# EAGLE design lcd (EAGLE 6.5.0)
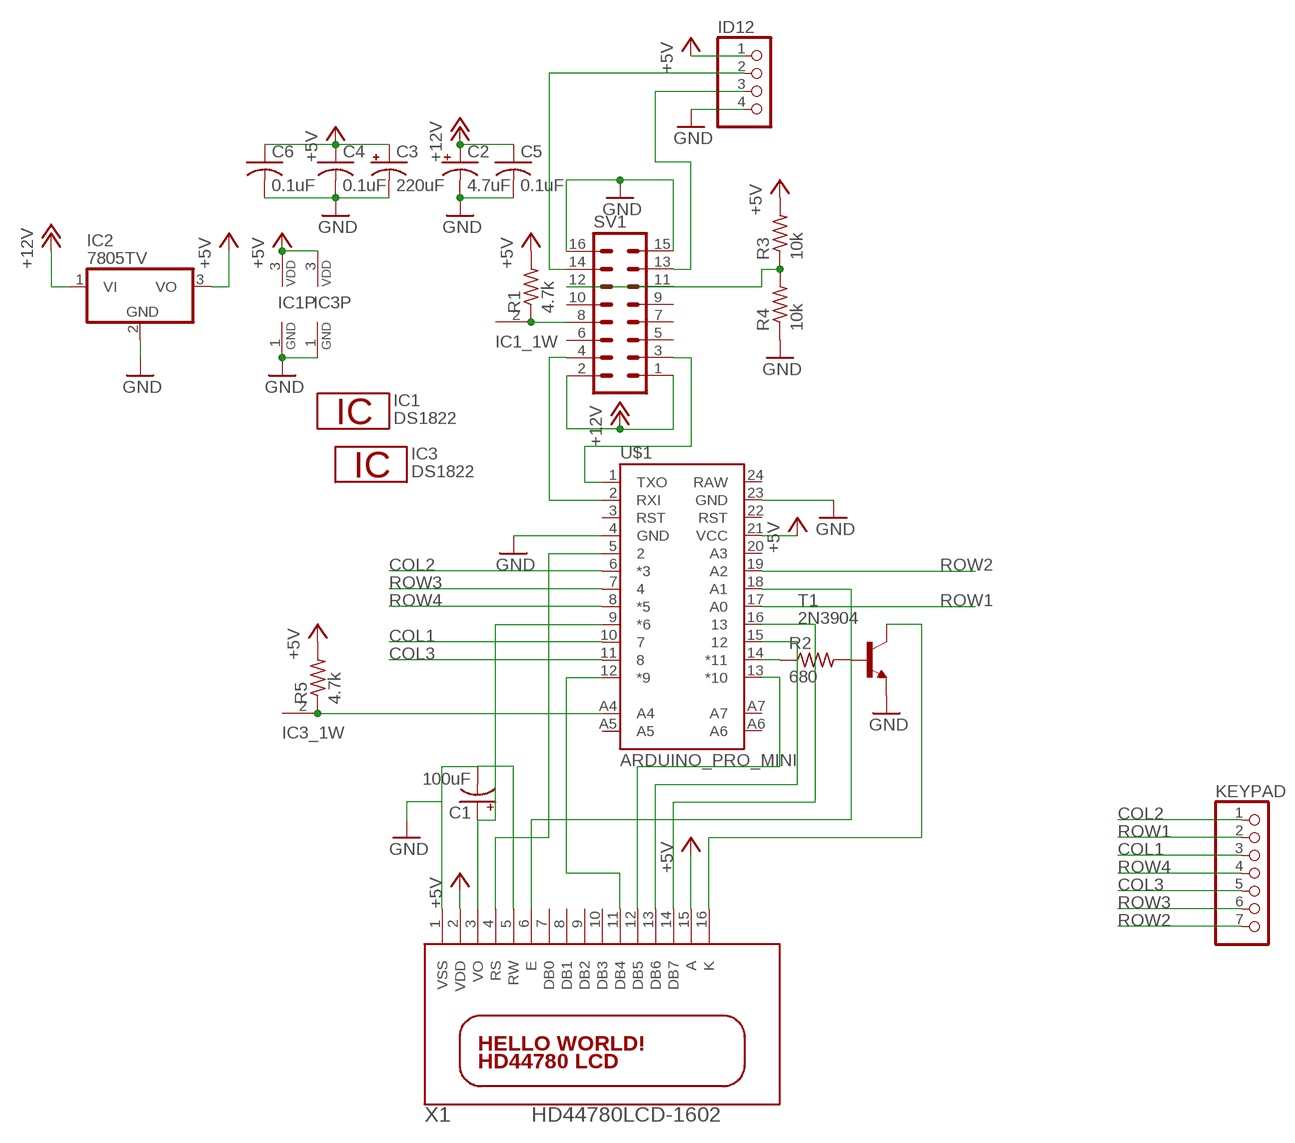
[diagram p0: schematic, sheet 1]

## Parts
C1  100uF  CPOL-USE2.5-7  [E2,5-7]
C2  4.7uF  CPOL-USE2.5-6  [E2,5-6]
C3  220uF  CPOL-USE5-8.5  [E5-8,5]
C4  0.1uF  C-US025-025X050  [C025-025X050]
C5  0.1uF  C-US025-025X050  [C025-025X050]
C6  0.1uF  C-US025-025X050  [C025-025X050]
IC1  DS1822  [TO92-]
IC2  7805TV  [TO220V]
IC3  DS1822  [TO92-]
ID12  PINHD-1X4  [1X04]
KEYPAD  PINHD-1X7  [1X07]
R1  4.7k  R-US_0207/5V  [0207/5V]
R2  680  R-US_0207/5V  [0207/5V]
R3  10k  R-US_0204/2V  [0204V]
R4  10k  R-US_0204/2V  [0204V]
R5  4.7k  R-US_0207/5V  [0207/5V]
SV1  ML16  [ML16]
T1  2N3904  [TO92]
U$1  ARDUINO_PRO_MINI  [ARDUINO_PRO_MINI]
X1  HD44780LCD-1602  [LCD1602]

## Nets
+5V: C3.+ C4.1 C6.1 IC1.3 IC2.3(VO) IC3.3 ID12.1 R1.2 R3.2 R5.2 U$1.21(VCC) X1.2(VDD) X1.15(A)
+12V: C2.+ C5.1 IC2.1(VI) SV1.1 SV1.2
COL1: KEYPAD.3 U$1.10
COL2: KEYPAD.1 U$1.6(*3)
COL3: KEYPAD.5 U$1.11
GND: C1.- C2.- C3.- C4.2 C5.2 C6.2 IC1.1 IC2.2(GND) IC3.1 ID12.4 R4.1 SV1.15 SV1.16 T1.3(E) U$1.4(GND) U$1.23(GND) X1.1(VSS) X1.5(RW)
N$1: IC1.2 R1.1 SV1.8
N$2: C1.+ U$1.9(*6) X1.3(VO)
N$3: SV1.4 U$1.2(RXI)
N$4: R2.1 U$1.14(*11)
N$5: R2.2 T1.2(B)
N$6: SV1.3 U$1.1(TXO)
N$7: ID12.2 SV1.14
N$8: ID12.3 SV1.13
N$9: T1.1(C) X1.16(K)
N$10: U$1.5 X1.4(RS)
N$11: U$1.18(A1) X1.6(E)
N$12: U$1.12(*9) X1.11(DB4)
N$13: U$1.13(*10) X1.12(DB5)
N$14: U$1.15 X1.13(DB6)
N$15: U$1.16 X1.14(DB7)
N$16: R3.1 R4.2 SV1.12
N$17: IC3.2 R5.1 U$1.A4
ROW1: KEYPAD.2 U$1.17(A0)
ROW2: KEYPAD.7 U$1.19(A2)
ROW3: KEYPAD.6 U$1.7
ROW4: KEYPAD.4 U$1.8(*5)
Unconnected: SV1.5 SV1.6 SV1.7 SV1.9 SV1.10 SV1.11 U$1.3(RST) U$1.20(A3) U$1.22(RST) U$1.24(RAW) U$1.A5 U$1.A6 U$1.A7 X1.7(DB0) X1.8(DB1) X1.9(DB2) X1.10(DB3)

## Library data of the parts
C1-C3 = resistor:CPOL-US: POLARIZED CAPACITOR, American symbol
C4-C6 = resistor:C-US: CAPACITOR, American symbol
IC1 IC3 = 1wire:DS1822: Econo Digital Thermometer This chip provides a onewire thermosensor with approx. 2°C accuracy. A programmable over/undertemperure alarm is available. Notes: Vdd must be applied for accurate measurements at low temperatures, as the parasite power circuit otherwise heats the sensor. If parasite power is used, Vdd has to be connected to GND. The DS18B20 and DS18S20 are similar chips with approx. 0.5°C accuracy. Author: Jan Kandziora <jjj@gmx.de>
IC2 = linear:78*: Positive VOLTAGE REGULATOR Source: http://cache.national.com/ds/LM/LM78L05.pdf http://www.fairchildsemi.com/ds/LM/LM7805.pdf
ID12 = pinhead:PINHD-1X4: PIN HEADER
KEYPAD = pinhead:PINHD-1X7: PIN HEADER
R1-R5 = resistor:R-US_: RESISTOR, American symbol
SV1 = con-harting-ml:ML16: HARTING; OC_FARNELL: unknown; OC_NEWARK: unknown
T1 = transistor:2N3904: NPN TRANSISTOR
U$1 = SparkFun-Boards:ARDUINO_PRO_MINI
X1 = adafruit:HD44780LCD: HD44780 LCD Standard character type LCDs, available in sizes from 8x1 to 40x4!

## Board
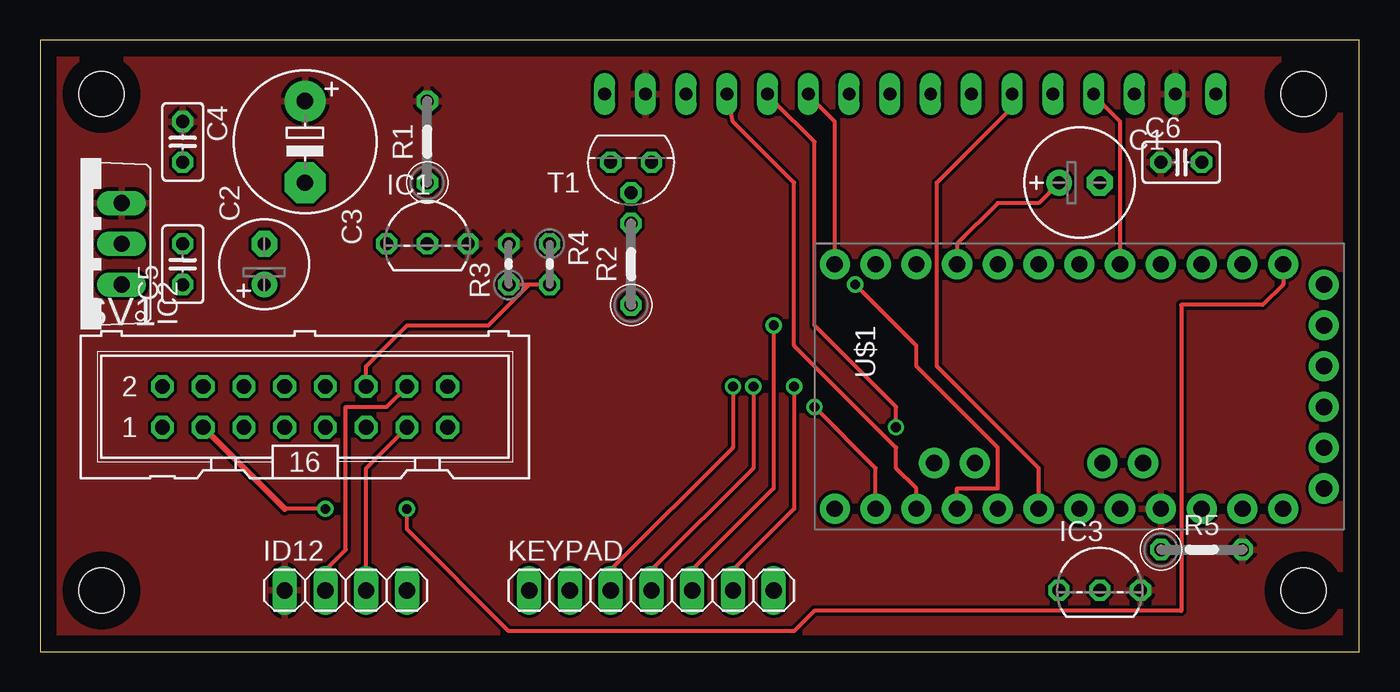
[diagram p1: board, top side]
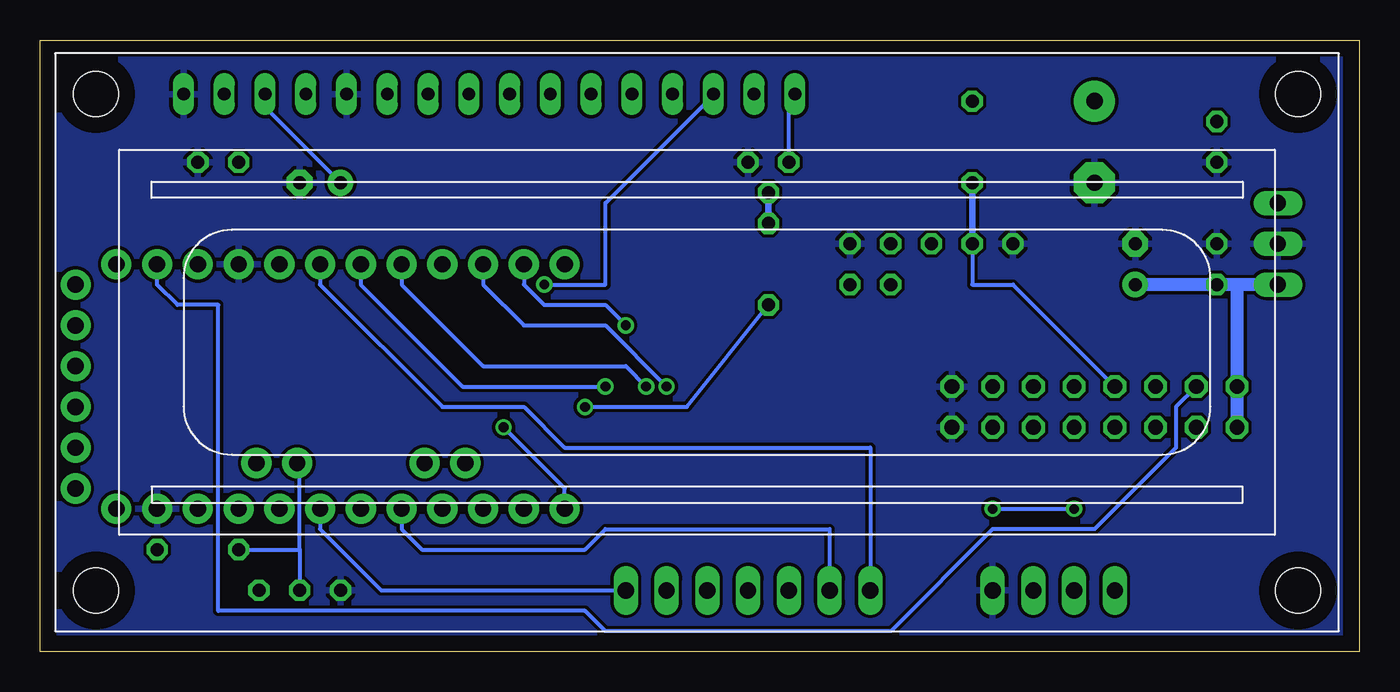
[diagram p2: board, bottom side, seen from below]

Size 82.22 x 38.09 mm. Coordinates in mm from the lower left corner, seen from the top.
Outline: 0,0 82.22,0 82.22,38.09 0,38.09 0,0
Copper layers (1*16): Top 0.035mm / dielectric 1.5mm / Bottom 0.035mm
Design rules "default": minimum track width 10mil, minimum drill 24mil, track to track 8mil, track to pad 8mil, pad to pad 8mil, via to via 8mil, smd to smd 8mil, copper to edge 40mil, drill to drill 8mil, minimum pad ring 10mil, minimum via ring 8mil, stop-mask expansion 4mil, vias tented up to drill 0mil, thermal gap 10mil

### Footprints (pad centres in the part's own frame; a part is rotated, then mirrored left to right if it is on the bottom)
E2,5-7 = drill 0.813 pad 1.6: + -1.27,0 | drill 0.813 pad 1.6 octagon: - 1.27,0
E2,5-6 = drill 0.813 pad 1.6: + -1.27,0 | drill 0.813 pad 1.6 octagon: - 1.27,0
E5-8,5 = drill 1.016 pad 2.54: + -2.54,0 | drill 1.016 pad 2.54 octagon: - 2.54,0
C025-025X050 = drill 0.813 octagon: 1 -1.27,0; 2 1.27,0
TO92- = drill 0.813 octagon: 1 -2.54,0; 2 0,0; 3 2.54,0
TO220V = drill 1.016 long: 1 -2.54,-2.54; 2 0,-2.54; 3 2.54,-2.54
1X04 = drill 1.016 long: 1 -3.81,0; 2 -1.27,0; 3 1.27,0; 4 3.81,0
1X07 = drill 1.016 long: 1 -7.62,0; 2 -5.08,0; 3 -2.54,0; 4 0,0; 5 2.54,0; 6 5.08,0; 7 7.62,0
0207/5V = drill 0.813 octagon: 1 -2.54,0; 2 2.54,0
0204V = drill 0.813 octagon: 1 -1.27,0; 2 1.27,0
ML16 = drill 0.914 octagon: 1 -8.89,-1.27; 2 -8.89,1.27; 3 -6.35,-1.27; 4 -6.35,1.27; 5 -3.81,-1.27; 6 -3.81,1.27; 7 -1.27,-1.27; 8 -1.27,1.27; 9 1.27,-1.27; 10 1.27,1.27; 11 3.81,-1.27; 12 3.81,1.27; 13 6.35,-1.27; 14 6.35,1.27; 15 8.89,-1.27; 16 8.89,1.27
TO92 = drill 0.813 octagon: 1 1.27,0; 2 0,1.905; 3 -1.27,0
ARDUINO_PRO_MINI = drill 1.016 pad 1.88: 1 -7.62,12.7; 2 -7.62,10.16; 3 -7.62,7.62; 4 -7.62,5.08; 5 -7.62,2.54; 6 -7.62,0; 7 -7.62,-2.54; 8 -7.62,-5.08; 9 -7.62,-7.62; 10 -7.62,-10.16; 11 -7.62,-12.7; 12 -7.62,-15.24; 13 7.62,-15.24; 14 7.62,-12.7; 15 7.62,-10.16; 16 7.62,-7.62; 17 7.62,-5.08; 18 7.62,-2.54; 19 7.62,0; 20 7.62,2.54; 21 7.62,5.08; 22 7.62,7.62; 23 7.62,10.16; 24 7.62,12.7; A4 4.763,1.429; A5 4.763,3.969; A6 4.763,-9.049; A7 4.763,-6.509; BLK -6.35,15.24; GND -3.81,15.24; GRN 6.35,15.24; RXI 1.27,15.24; TXO 3.81,15.24; VCC -1.27,15.24
LCD1602 = drill 0.8 long: 1 8,33.46; 2 10.54,33.46; 3 13.08,33.46; 4 15.62,33.46; 5 18.16,33.46; 6 20.7,33.46; 7 23.24,33.46; 8 25.78,33.46; 9 28.32,33.46; 10 30.86,33.46; 11 33.4,33.46; 12 35.94,33.46; 13 38.48,33.46; 14 41.02,33.46; 15 43.56,33.46; 16 46.1,33.46 | hole 2.8: 2.54,2.54; 2.54,33.46; 77.46,33.46; 77.46,2.54

### Placement (x,y rotation side)
C1  64.77,29.21 0 top
C2  13.97,24.13 90 top
C3  16.51,31.75 270 top
C4  8.89,31.75 270 top
C5  8.89,24.13 90 top
C6  71.12,30.48 0 top
IC1  24.13,25.4 0 top
IC2  2.54,25.4 90 top
IC3  66.04,3.81 0 top
ID12  19.05,3.81 0 top
KEYPAD  38.1,3.81 0 top
R1  24.13,31.75 90 top
R2  36.83,24.13 90 top
R3  29.21,24.13 90 top
R4  31.75,24.13 270 top
R5  72.39,6.35 0 top
SV1  16.51,15.24 0 top
T1  36.83,30.48 180 top
U$1  64.77,16.51 270 top
X1  81.28,1.27 0 bottom

### Tracks (layer width: path | path; a pad name or v marks a point on that pad's centre or on a via)
+5V
  pour Top: 90.17,-31.75 90.17,48.26 0,48.26 0,-33.02 90.17,-33.02
+12V
  Bottom 0.813: SV1.2 SV1.1 7.62,22.86 C5.1 | IC2.1 C5.1 | C5.1 C2.+
COL1  (via drill 0.61)
  Top 0.254: KEYPAD.3 35.56,5.08 43.18,12.7 v43.18,16.51
  Bottom 0.254: v43.18,16.51 46.99,20.32 52.07,20.32 54.61,22.86 U$1.10
COL2
  Bottom 0.254: KEYPAD.1 30.48,12.7 49.53,12.7 52.07,15.24 57.15,15.24 64.77,22.86 U$1.6
COL3  (via drill 0.61)
  Top 0.254: KEYPAD.5 40.64,5.08 45.72,10.16 v45.72,20.32
  Bottom 0.254: v45.72,20.32 46.99,21.59 50.8,21.59 52.07,22.86 U$1.11
GND
  pour Bottom: 90.17,48.26 90.17,-31.75 0,-31.75 0,48.26
N$1
  Bottom 0.254: SV1.8 21.59,22.86 24.13,22.86 IC1.2
  Bottom 0.406: R1.1 IC1.2
N$2
  Top 0.254: U$1.9 57.15,25.4 59.69,27.94 62.23,27.94 C1.+
  Bottom 0.254: C1.+ 68.58,34.29 X1.3
N$3
  Bottom 0.254: SV1.4 11.43,15.24 11.43,12.7 16.51,7.62 22.86,7.62 29.21,1.27 46.99,1.27 48.26,2.54 71.12,2.54 71.12,21.59 73.66,21.59 74.93,22.86 U$1.2
N$4  (via drill 0.61)
  Top 0.254: v48.26,15.24 52.07,11.43 U$1.14
  Bottom 0.254: R2.1 41.91,15.24 v48.26,15.24
N$5
  Bottom 0.406: T1.2 R2.2
N$6  (via drill 0.6)
  Top 0.254: U$1.1 77.47,22.86 76.2,21.59 71.12,21.59 71.12,2.54 48.26,2.54 46.99,1.27 29.21,1.27 22.86,7.62 v22.86,8.89 | v17.78,8.89 15.24,8.89
  Top 0.406: 15.24,8.89 SV1.3
  Bottom 0.254: v22.86,8.89 v17.78,8.89
N$7
  Top 0.254: SV1.14 21.59,15.24 19.05,15.24 19.05,6.35 17.78,5.08 ID12.2
N$8
  Top 0.254: SV1.13 20.32,11.43 ID12.3
N$9
  Bottom 0.254: T1.1 35.56,34.29 X1.16
N$10
  Top 0.254: U$1.5 67.31,33.02 66.04,34.29 X1.4
N$11
  Top 0.254: U$1.18 62.23,11.43 55.88,17.78 55.88,29.21 60.96,34.29 X1.6
N$12
  Top 0.254: U$1.12 49.53,33.02 48.26,34.29 X1.11
N$13  (via drill 0.61)
  Top 0.254: v53.34,13.97 53.34,15.24 48.26,20.32 48.26,31.75 45.72,34.29 X1.12
  Bottom 0.254: v53.34,13.97 49.53,10.16 U$1.13
N$14
  Top 0.254: U$1.15 54.61,10.16 53.34,11.43 53.34,12.7 46.99,19.05 46.99,29.21 43.18,33.02 X1.13
N$15  (via drill 0.61)
  Top 0.254: v50.8,22.86 54.61,19.05 54.61,17.78 59.69,12.7 59.69,10.16 57.15,10.16 U$1.16
  Bottom 0.254: v50.8,22.86 46.99,22.86 46.99,27.94 40.64,34.29 X1.14
N$16
  Top 0.254: SV1.12 20.32,17.78 22.86,20.32 27.94,20.32 30.48,22.86 | 30.48,22.86 R3.1 | R4.2 30.48,22.86
N$17
  Bottom 0.254: 66.04,6.35 IC3.2 | R5.1 66.04,6.35 | 66.04,6.35 66.04,11.43 U$1.A4
ROW1
  Bottom 0.254: KEYPAD.2 33.02,7.62 46.99,7.62 48.26,6.35 58.42,6.35 59.69,7.62 U$1.17
ROW2
  Bottom 0.254: KEYPAD.7 60.96,3.81 64.77,7.62 U$1.19
ROW3  (via drill 0.61)
  Top 0.254: KEYPAD.6 43.18,5.08 46.99,8.89 v46.99,16.51
  Bottom 0.254: v46.99,16.51 55.88,16.51 62.23,22.86 U$1.7
ROW4  (via drill 0.61)
  Top 0.254: KEYPAD.4 38.1,5.08 44.45,11.43 v44.45,16.51
  Bottom 0.254: v44.45,16.51 45.72,17.78 54.61,17.78 59.69,22.86 U$1.8